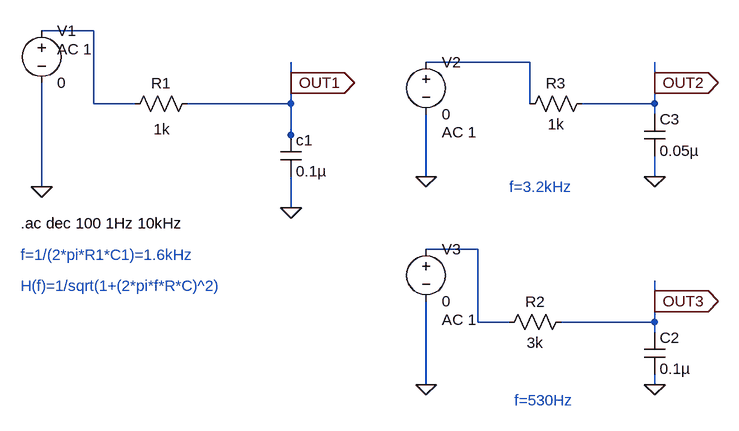
[diagram p0: schematic 一阶低通滤波器.asc]
一阶低通滤波器.asc, the LTspice schematic file:
Version 4.1
SHEET 1 1664 680
WIRE 48 -144 -32 -144
WIRE 720 -96 560 -96
WIRE 352 -64 352 -96
WIRE 912 -64 912 -96
WIRE 48 -32 48 -144
WIRE 112 -32 48 -32
WIRE 352 -32 352 -64
WIRE 352 -32 192 -32
WIRE 720 -32 720 -96
WIRE 912 -32 912 -64
WIRE 912 -32 800 -32
WIRE 912 -16 912 -32
WIRE 352 16 352 -32
WIRE 352 32 352 16
WIRE 560 80 560 -16
WIRE 912 80 912 48
WIRE -32 96 -32 -64
WIRE 352 128 352 80
WIRE 640 192 560 192
WIRE 912 272 912 240
WIRE 640 304 640 192
WIRE 688 304 640 304
WIRE 912 304 912 272
WIRE 912 304 768 304
WIRE 912 320 912 304
WIRE 560 400 560 272
WIRE 912 400 912 384
FLAG 352 128 0
FLAG 352 -64 OUT1
IOPIN 352 -64 Out
FLAG -32 96 0
FLAG 560 400 0
FLAG 912 400 0
FLAG 560 80 0
FLAG 912 80 0
FLAG 912 -64 OUT2
IOPIN 912 -64 Out
FLAG 912 272 OUT3
IOPIN 912 272 Out
SYMBOL voltage -32 -160 R0
WINDOW 123 24 44 Left 2
WINDOW 39 0 0 Left 0
SYMATTR Value2 AC 1
SYMATTR InstName V1
SYMATTR Value 0
SYMBOL res 208 -48 R90
WINDOW 0 0 56 VBottom 2
WINDOW 3 71 55 VBottom 2
SYMATTR InstName R1
SYMATTR Value 1k
SYMBOL cap 336 16 R0
SYMATTR InstName c1
SYMATTR Value 0.1µ
SYMBOL res 784 288 R90
WINDOW 0 0 56 VBottom 2
WINDOW 3 32 56 VTop 2
SYMATTR InstName R2
SYMATTR Value 3k
SYMBOL cap 896 320 R0
SYMATTR InstName C2
SYMATTR Value 0.1µ
SYMBOL voltage 560 176 R0
WINDOW 123 24 124 Left 2
WINDOW 39 0 0 Left 0
SYMATTR InstName V3
SYMATTR Value 0
SYMATTR Value2 AC 1
SYMBOL voltage 560 -112 R0
WINDOW 123 24 124 Left 2
WINDOW 39 0 0 Left 0
SYMATTR InstName V2
SYMATTR Value 0
SYMATTR Value2 AC 1
SYMBOL res 816 -48 R90
WINDOW 0 0 56 VBottom 2
WINDOW 3 32 56 VTop 2
SYMATTR InstName R3
SYMATTR Value 1k
SYMBOL cap 896 -16 R0
SYMATTR InstName C3
SYMATTR Value 0.05µ
TEXT -64 152 Left 2 !.ac dec 100 1Hz 10kHz
TEXT -64 200 Left 2 ;f=1/(2*pi*R1*C1)=1.6kHz
TEXT 688 96 Left 2 ;f=3.2kHz
TEXT 696 424 Left 2 ;f=530Hz
TEXT -64 248 Left 2 ;H(f)=1/sqrt(1+(2*pi*f*R*C)^2)

The netlist it stands for:
* 一阶低通滤波器.asc
V1 N001 0 0 AC 1
R1 OUT1 N001 1k
c1 OUT1 0 0.1µ
R2 OUT3 N003 3k
C2 OUT3 0 0.1µ
V3 N003 0 0 AC 1
V2 N002 0 0 AC 1
R3 OUT2 N002 1k
C3 OUT2 0 0.05µ
.ac dec 100 1Hz 10kHz
* f=1/(2*pi*R1*C1)=1.6kHz
* f=3.2kHz
* f=530Hz
* H(f)=1/sqrt(1+(2*pi*f*R*C)^2)
.backanno
.end